# Altium schematic sheet 07_nRF52840_Digital.SchDoc
size 420 x 297 mm; Author: Shpakov Dmitry; Address1: Address1; Address2: Address2; Address3: Address3; Address4: Address4; DocumentNumber: АБВГ.123456.001 Э3; SheetNumber: 8; SheetTotal: 13; Scale: 1:1; DocumentType: Схема электрическая принципиальная; FirstReferrence: АБВГ.123456.001
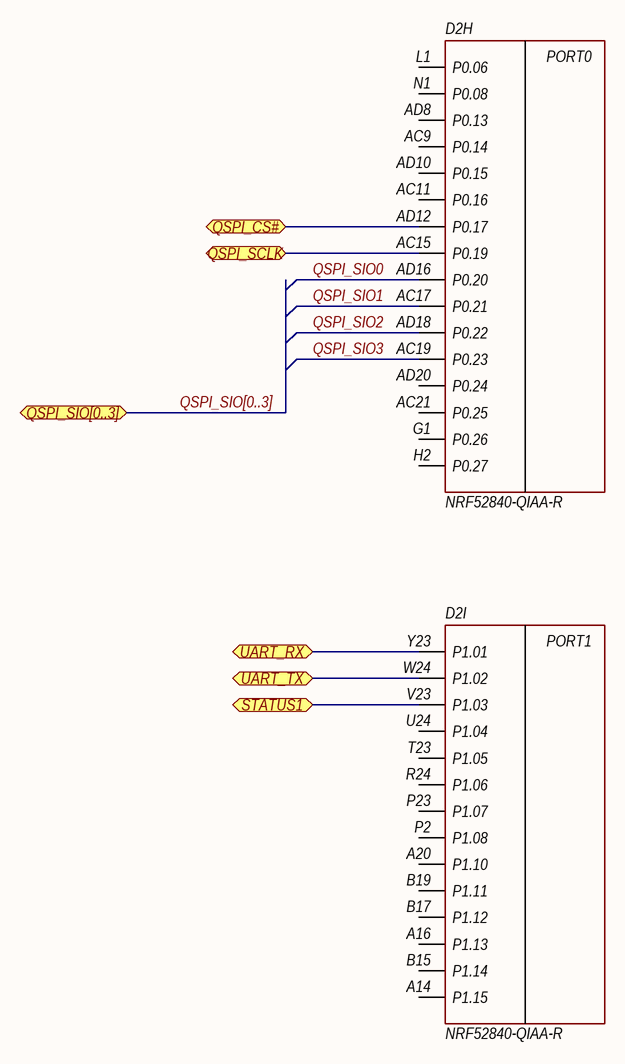
[diagram p0: 07_nRF52840_Digital.SchDoc]

## Parts
D2  NRF52840-QIAA-R  [AQFN50P700X700X85_HS-74N]  (parts H,I of 9)

## Ports
QSPI_CS#, QSPI_SCLK, QSPI_SIO[0..3], STATUS1, UART_RX, UART_TX

## Nets
QSPI_CS#: D2.AD12(P0.17) ; port QSPI_CS#
QSPI_SCLK: D2.AC15(P0.19) ; port QSPI_SCLK
QSPI_SIO0: D2.AD16(P0.20)
QSPI_SIO1: D2.AC17(P0.21)
QSPI_SIO2: D2.AD18(P0.22)
QSPI_SIO3: D2.AC19(P0.23)
STATUS1: D2.V23(P1.03) ; port STATUS1
UART_RX: D2.Y23(P1.01) ; port UART_RX
UART_TX: D2.W24(P1.02) ; port UART_TX

Not connected (* = marked no-connect by the designer): D2 A14(P1.15) A16(P1.13) A20(P1.10) AC9(P0.14) AC11(P0.16) AC21(P0.25) AD8(P0.13) AD10(P0.15) AD20(P0.24) B15(P1.14) B17(P1.12) B19(P1.11) G1(P0.26) H2(P0.27) L1(P0.06) N1(P0.08) P2(P1.08) P23(P1.07) R24(P1.06) T23(P1.05) U24(P1.04)

## Buses and harness runs
bus QSPI_SIO[0..3] = port QSPI_SIO[0..3]

## Notes on the sheet
- Author
- Manufacturer
- Date
- Page
- Total pages
- Size page
- A3
- Materials
- (in symbol nRF52840-QFN373, part H) PORT0
- (in symbol nRF52840-QFN373, part I) PORT1

## Library data of the parts
D2 = nRF52840-QFN373: IC RF TxRx + MCU 802.15.4, Bluetooth Bluetooth v5.0 2.4GHz 73-VFQFN Dual Rows, Exposed Pad; Manufacturer: Nordic Semiconductor ASA; Power/Voltage: 1.7V ~ 5.5V; Operation Temperature: -40...+85; Help URL: https://www.digikey.com/en/products/detail/nexperia-usa-inc/2N7002-215/762973; Type: IC RF TXRX+MCU 802.15.4; Value: *; Tolerance: *; Note: *; Case: 73-aQFN (7x7); PartNumber: NRF52840-QIAA-R